# EAGLE schematic spotlight (EAGLE 9.5.0)
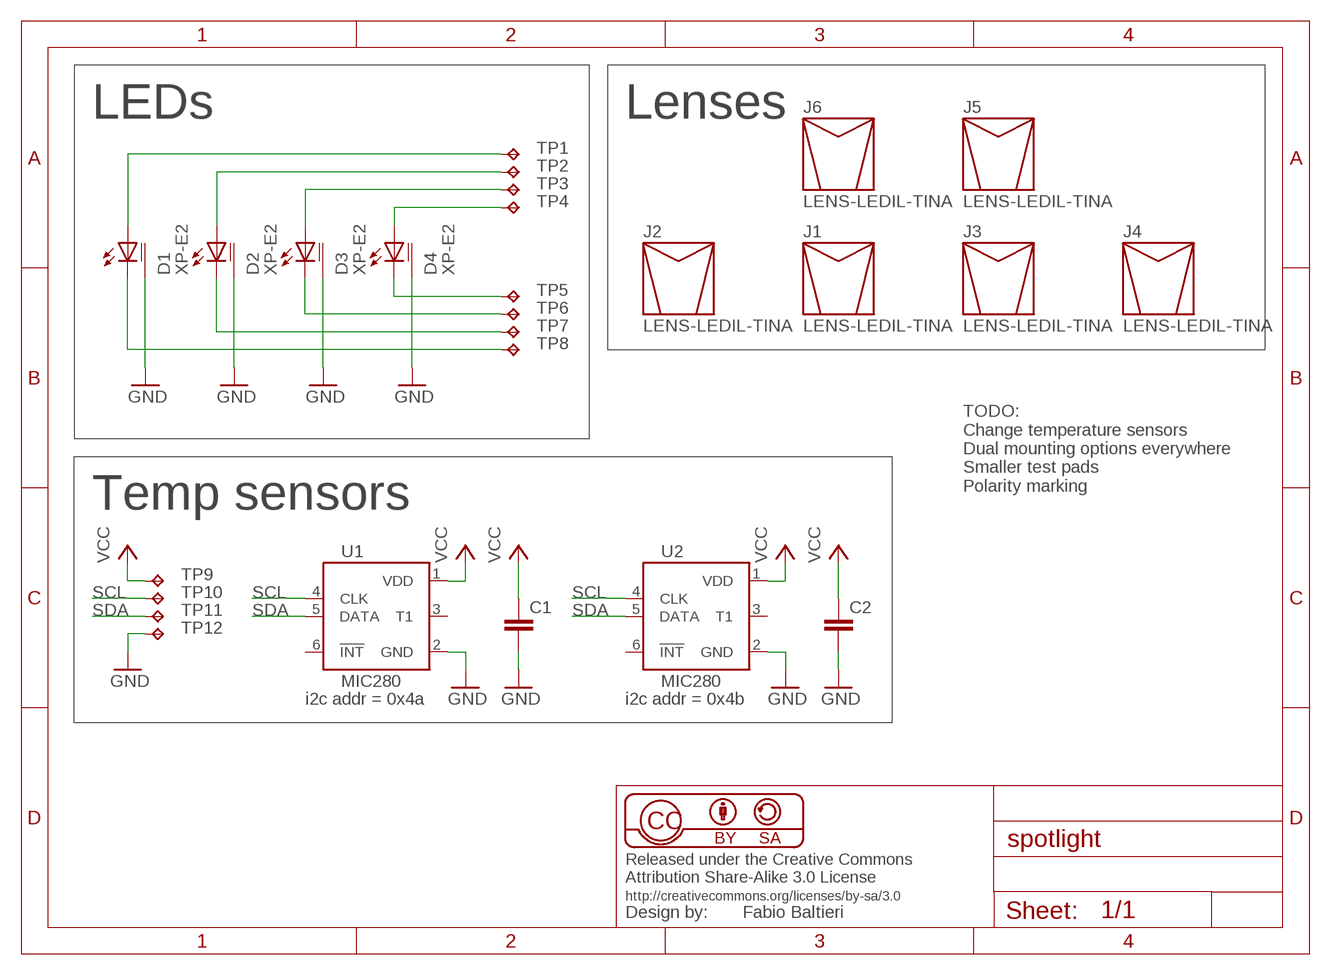
[diagram p0: schematic, sheet 1]

## Parts
C1  C0603  [0603]
C2  C0603  [0603]
D1  XP-E2  LED_CREE-XP-E  [CREE_XPE]
D2  XP-E2  LED_CREE-XP-E  [CREE_XPE]
D3  XP-E2  LED_CREE-XP-E  [CREE_XPE]
D4  XP-E2  LED_CREE-XP-E  [CREE_XPE]
J1  LENS-LEDIL-TINA  [LEDIL-TINA]
J2  LENS-LEDIL-TINA  [LEDIL-TINA]
J3  LENS-LEDIL-TINA  [LEDIL-TINA]
J4  LENS-LEDIL-TINA  [LEDIL-TINA]
J5  LENS-LEDIL-TINA  [LEDIL-TINA]
J6  LENS-LEDIL-TINA  [LEDIL-TINA]
TP1  TPTP18R  [TP18R]
TP2  TPTP18R  [TP18R]
TP3  TPTP18R  [TP18R]
TP4  TPTP18R  [TP18R]
TP5  TPTP18R  [TP18R]
TP6  TPTP18R  [TP18R]
TP7  TPTP18R  [TP18R]
TP8  TPTP18R  [TP18R]
TP9  TPTP14R  [TP14R]
TP10  TPTP14R  [TP14R]
TP11  TPTP14R  [TP14R]
TP12  TPTP14R  [TP14R]
U1  MIC280  [SOT23-6L]
U2  MIC280  [SOT23-6L]

## Nets
GND: C1.2 C2.2 D1.TH D2.TH D3.TH D4.TH TP12.TP U1.2(GND) U2.2(GND)
N$1: D4.K(C) TP5.TP
N$2: D3.K(C) TP6.TP
N$3: D2.K(C) TP7.TP
N$4: D1.K(C) TP8.TP
N$5: D4.A TP4.TP
N$6: D3.A TP3.TP
N$7: D2.A TP2.TP
N$8: D1.A TP1.TP
SCL: TP10.TP U1.4(CLK) U2.4(CLK)
SDA: TP11.TP U1.5(DATA) U2.5(DATA)
VCC: C1.1 C2.1 TP9.TP U1.1(VDD) U2.1(VDD)
Unconnected: U1.3(T1) U1.6(!INT) U2.3(T1) U2.6(!INT)

## Notes on the sheet
- LEDs | Lenses
- TODO:
  Change temperature sensors
  Dual mounting options everywhere
  Smaller test pads
  Polarity marking
- Temp sensors
- i2c addr = 0x4a | i2c addr = 0x4b

## Library data of the parts
C1 C2 = balto:C: Capacitor
D1-D4 = balto:LED_CREE-XP-E: Cree XLamp XP-E LEDs
J1-J6 = balto:LENS: LED Lens
TP1-TP12 = testpad:TP: Test pad
U1 U2 = balto:MIC280: MIC280 Precision IttyBitty Thermal Supervisor